# EAGLE schematic MainBoard_V1 (EAGLE 9.6.2)
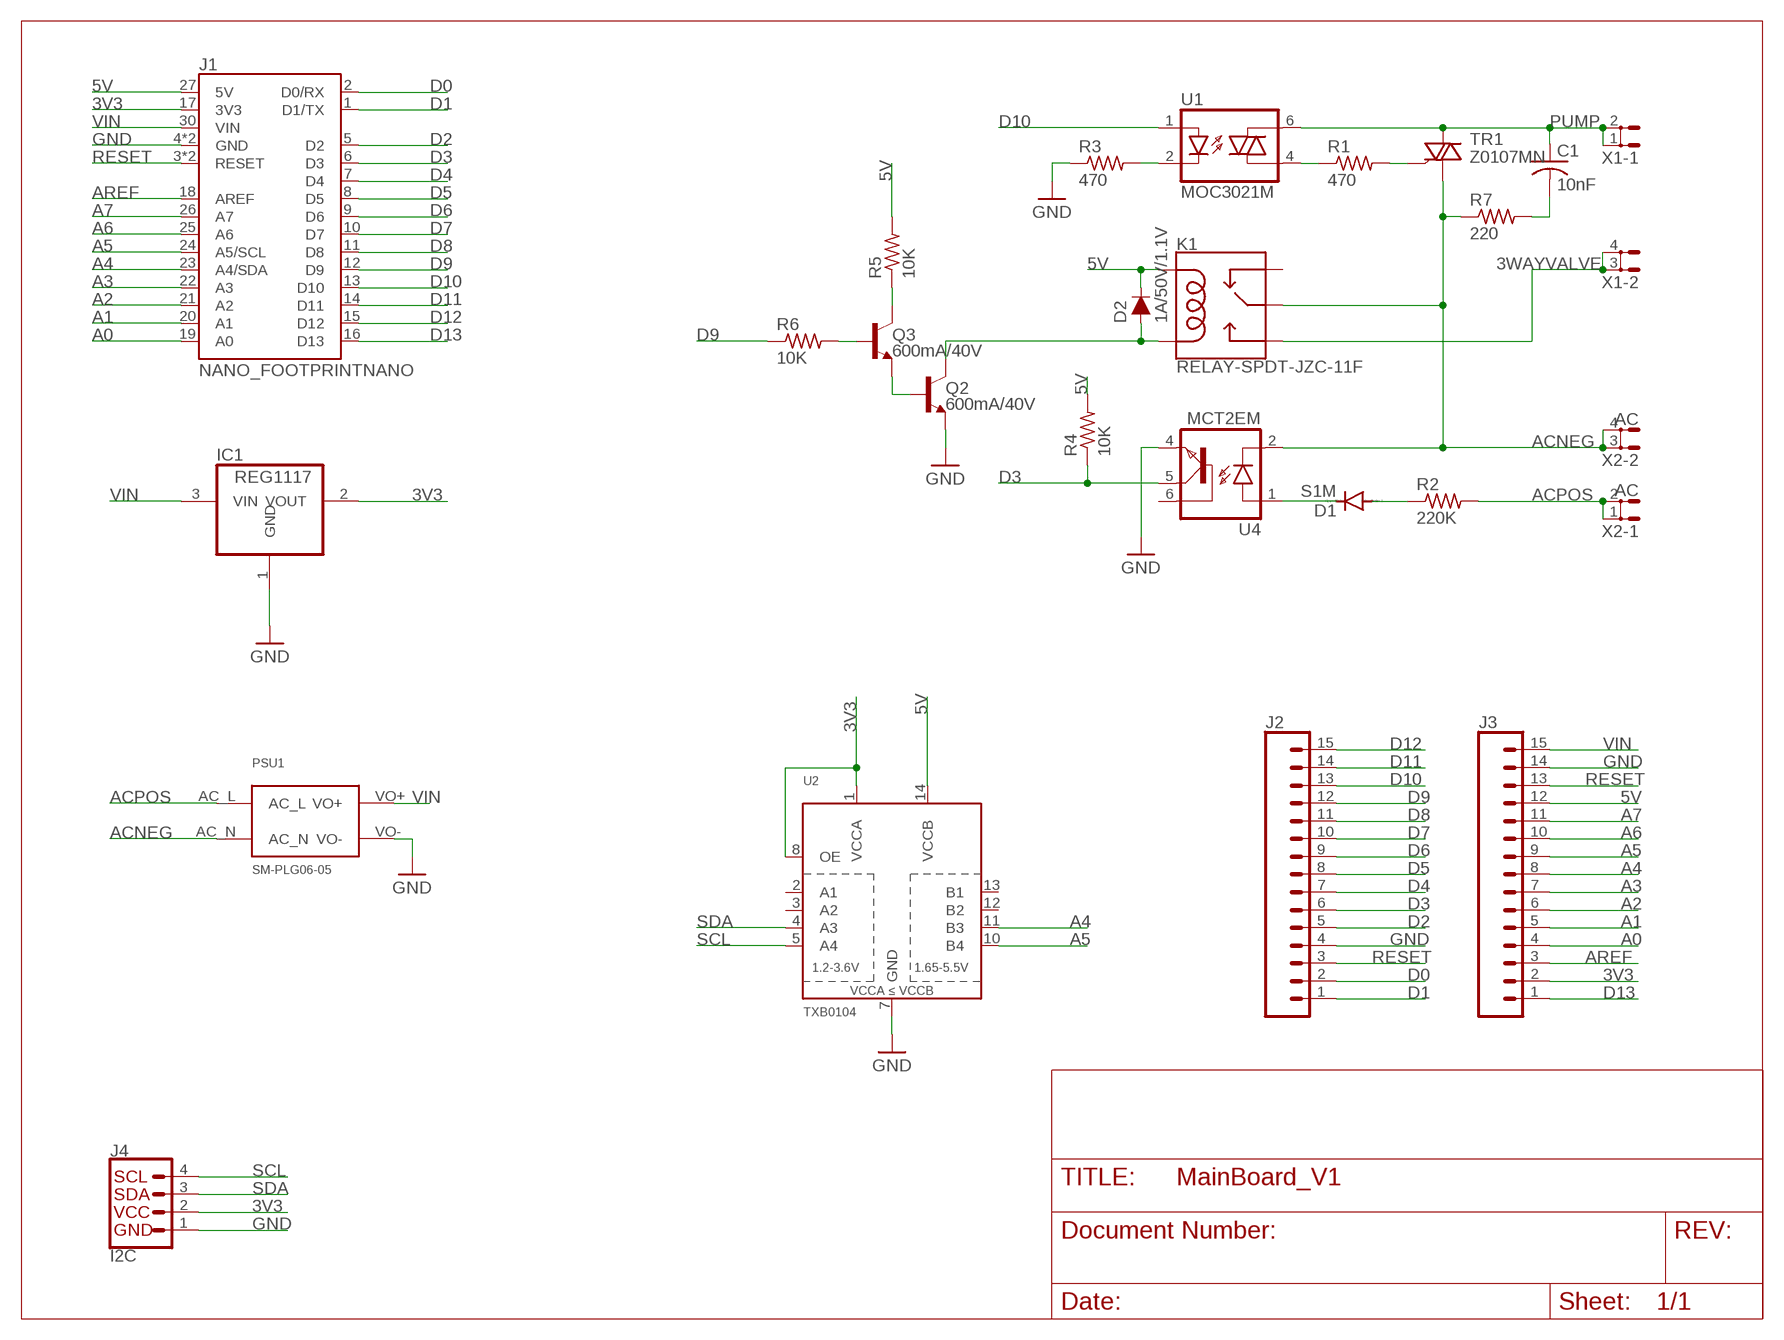
[diagram p0: schematic, sheet 1]

## Parts
C1  10nF  C-US075-032X103  [C075-032X103]
D1  S1M  [SMA]
D2  1A/50V/1.1V  DIODE-PTH  [DIODE-1N4001]
IC1  REG1117  [SOT223]
J1  NANO_FOOTPRINTNANO  [NANO]
J2  CONN_15  [1X15]
J3  CONN_15  [1X15]
J4  I2C  QWIIC_CONNECTOR  [JST04_1MM_VERT]
K1  RELAY-SPDT-JZC-11F  [RELAY-JZC]
PSU1  SM-PLG06-05  [SM-PLG06]
Q2  600mA/40V  TRANS_NPN-MMBT2222AL  [SOT23-3]
Q3  600mA/40V  TRANS_NPN-MMBT2222AL  [SOT23-3]
R1  470  R-US_R0402  [R0402]
R2  220K  R-US_R0603  [R0603]
R3  470  R-US_R0402  [R0402]
R4  10K  R-US_R0402  [R0402]
R5  10K  R-US_R0402  [R0402]
R6  10K  R-US_R0402  [R0402]
R7  220  R-US_R2512  [R2512]
TR1  Z0107MN  Z0107MNSOT-223  [SOT223]
U1  MOC3021M  [DIL06]
U2  TXB0104  TXB0104PWRSOIC14  [SO14]
U4  MCT2EM  [PDIP6_8P89X6P60_ONS]
X1  SH5-2  [SH5-2]
X2  AC  SH5-2  [SH5-2]

## Nets
3V3: IC1.2(VOUT) J1.17(3V3) J3.2 J4.2 U2.1(VCCA) U2.8(OE)
3WAYVALVE: K1.3(NO) X1.3 X1.4
5V: D2.C J1.27(5V) J3.12 K1.5(COIL1) R4.2 R5.2 U2.14(VCCB)
A0: J1.19(A0) J3.4
A1: J1.20(A1) J3.5
A2: J1.21(A2) J3.6
A3: J1.22(A3) J3.7
A4: J1.23(A4/SDA) J3.8 U2.11(B3)
A5: J1.24(A5/SCL) J3.9 U2.10(B4)
A6: J1.25(A6) J3.10
A7: J1.26(A7) J3.11
ACNEG: K1.4(MAIN) PSU1.AC_N R7.1 TR1.1(A1) U4.2(C) X2.3 X2.4
ACPOS: PSU1.AC_L R2.2 X2.1 X2.2
AREF: J1.18(AREF) J3.3
D0: J1.2(D0/RX) J2.2
D1: J1.1(D1/TX) J2.1
D2: J1.5(D2) J2.5
D3: J1.6(D3) J2.6 R4.1 U4.5(COL)
D4: J1.7(D4) J2.7
D5: J1.8(D5) J2.8
D6: J1.9(D6) J2.9
D7: J1.10(D7) J2.10
D8: J1.11(D8) J2.11
D9: J1.12(D9) J2.12 R6.1
D10: J1.13(D10) J2.13 U1.1(A)
D11: J1.14(D11) J2.14
D12: J1.15(D12) J2.15
D13: J1.16(D13) J3.1
GND: IC1.1(GND) J1.4(GND) J1.29(GND) J2.4 J3.14 J4.1 PSU1.VO- Q2.2(E) R3.1 U2.7(GND) U4.4(EMI)
N$1: R1.1 U1.4(A1)
N$2: R1.2 TR1.3(G)
N$3: R3.2 U1.2(C)
N$4: C1.2 R7.2
N$5: D1.A R2.1
N$6: D1.C U4.1(A)
N$8: Q2.1(B) Q3.2(E)
N$9: D2.A K1.1(COIL2) Q2.3(C)
N$10: Q3.3(C) R5.1
N$11: Q3.1(B) R6.2
PUMP: C1.1 TR1.2(A2) TR1.4(A2) U1.6(A2) X1.1 X1.2
RESET: J1.3(RESET) J1.28(RESET) J2.3 J3.13
SCL: J4.4 U2.5(A4)
SDA: J4.3 U2.4(A3)
VIN: IC1.3(VIN) J1.30(VIN) J3.15 PSU1.VO+
Unconnected: K1.2(NC) U2.2(A1) U2.3(A2) U2.12(B2) U2.13(B1) U4.6(BAS)

## Library data of the parts
C1 = rcl:C-US: CAPACITOR, American symbol; SPICEPREFIX: C
D1 = diode:S1M
D2 = SparkFun-DiscreteSemi:DIODE: Diode These are standard reverse protection diodes and small signal diodes. SparkFun Products: SparkFun SparkPunk Sound Kit <https://www.sparkfun.com/products/11177> SparkFun ESP8266 Thing <https://www.sparkfun.com/products/13231>; PROD_ID: DIO-09176
IC1 = burr-brown:REG1117: 800mA and 1A Low Dropout (LDO) Positive Regulator 1.8V, 2.5V, 2.85V, 3.3V, 5V, and Adj; MPN: REG1117; OC_FARNELL: 1097566; OC_NEWARK: 14P6981
J1 = SparkFun-Boards:NANO_FOOTPRINT: Generic Nano Footprint
J2 J3 = SparkFun-Connectors:CONN_15: Multi connection point. Often used as Generic Header-pin footprint for 0.1 inch spaced/style header connections On any of the 0.1 inch spaced packages, you can populate with these: Break Away Headers - Straight <https://www.sparkfun.com/products/116> (PRT-00116) Break Away Male Headers - Right Angle <https://www.sparkfun.com/products/553> (PRT-00553) Female Headers <https://www.sparkfun.com/products/115> (PRT-00115) Break Away Headers - Machine Pin <https://www.sparkfun.com/products/117> (PRT-00117) Break Away Female Headers - Swiss Machine Pin <https://www.sparkfun.com/products/743> (PRT-00743) For SCREWTERMINALS and SPRING TERMINALS visit here: Screw Terimnals on SparkFun.com <https://www.sparkfun.com/search/results?term=Screw+Terminals> (5mm/3.5mm/2.54mm spacing) This device is also useful as a general connection point to wire up your design to another part of your project. Our various solder wires solder well into these plated through hole pads. Hook-Up Wire - Assortment (Stranded, 22 AWG) <https://www.sparkfun.com/products/11375> (PRT-11375) Hook-Up Wire - Assortment (Solid Core, 22 AWG) <https://www.sparkfun.com/products/11367> (PRT-11367) View the entire wire category on our website here <https://www.sparkfun.com/categories/141> Special notes: Molex polarized connector foot print use with SKU : PRT-08231 with associated crimp pins and housings. 1MM SMD Version SKU: PRT-10208 NOTES ON THE VARIANTS LOCK and LOCK_LONGPADS... This footprint was designed to help hold the alignment of a through-hole component (i.e. 6-pin header) while soldering it into place. You may notice that each hole has been shifted either up or down by 0.005 of an inch from it's more standard position (which is a perfectly straight line). This slight alteration caused the pins (the squares in the middle) to touch the edges of the holes. Because they are alternating, it causes a "brace" to hold the component in place. 0.005 has proven to be the perfect amount of "off-center" position when using our standard breakaway headers. Although looks a little odd when you look at the bare footprint, once you have a header in there, the alteration is very hard to notice. Also,if you push a header all the way into place, it is covered up entirely on the bottom side.
J4 = SparkFun-Connectors:QWIIC_CONNECTOR: SparkFun I2C Standard Qwiic Connector An SMD 1mm pitch JST connector makes it easy and quick (get it? Qwiic?) to connect I2C devices to each other. The Qwiic system <http://www.sparkfun.com/qwiic> enables fast and solderless connection between popular platforms and various sensors and actuators. We carry 200mm <https://www.sparkfun.com/products/14204>, 100mm <https://www.sparkfun.com/products/14205>, 50mm <https://www.sparkfun.com/products/14206>, and breadboard friendly <https://www.sparkfun.com/products/14207> Qwiic cables. We also offer 10 pcs strips <https://www.sparkfun.com/products/14323> the SMD connectors.; PROD_ID: CONN-14483; VALUE: Vertical Qwiic Connector
K1 = SparkFun-Electromechanical:RELAY-SPDT: SPDT Electromechanical Relay Single-pole, double-throw sealed relays. When current is applied to the coil, it throws a simple changeover switch, terminating the connection from the NC contact to ground and closing the NO contact. Use them to switch high voltage/high current devices. SparkFun Products JQX-15F: Relay SPDT Sealed - 20A <https://www.sparkfun.com/products/10924> (COM-10924) JZC-11F: Relay SPDT Sealed <https://www.sparkfun.com/products/100> (COM-00100); PROD_ID: COMP-09533; SF_SKU: COM-00100
PSU1 = discrete:SM-PLG06-05: AC-DC 5V Isolated Switching Power Supply Module
Q2 Q3 = SparkFun-DiscreteSemi:TRANS_NPN: NPN transistor Current controlled devices typically used to amplify current or used as a switch. BC547 - COM-08928 <http://www.sparkfun.com/products/8928> (TO-92 45V 100mA) (1.Collector 2.Base 3.Emitter) 2N3904 - COM-00521 <http://www.sparkfun.com/products/521> (TO-92 40V 200mA) (1.Emitter 2.Base 3.Collector) P2N2222A - COM-12852 <http://www.sparkfun.com/products/12852> (TO-92 40V 600mA) (1.Collector 2.Base 3.Emitter); PROD_ID: TRANS-08049
R1-R7 = rcl:R-US_: RESISTOR, American symbol; SPICEPREFIX: R
TR1 = discrete:Z0107MN: Triacs 1.0 Amp 600 Volt
U1 = discrete:MOC3021M: RANDOM-PHASE OPTOISOLATORS TRIAC DRIVER OUTPUT
U2 = SparkFun-IC-Comms:TXB0104PWR: 4-Bit Bi-Directional Level Shifter 1.2V-3.6V (VCCA) to 1.65V-5.5V (VCCB) bi-directional level shifter with auto direction sensing. Max data rate - VCCA 1.8V: 20Mbps (50ns), VCCA 3.3V: 100Mbps (10ns) Digikey: 296-21929-1-ND (TSSOP) Datasheet <http://cdn.sparkfun.com/datasheets/BreakoutBoards/txb0104.pdf> SparkFun Products SparkFun Cellular Shield - MG2639 <https://www.sparkfun.com/products/13120> (CEL-13120) SparkFun Level Shifting microSD Breakout <https://www.sparkfun.com/products/13743> (DEV-13743) SparkFun Voltage-Level Translator Breakout - TXB0104 <https://www.sparkfun.com/products/11771> (BOB-11771) SparkFun Block for Intel® Edison - UART <https://www.sparkfun.com/products/13040> (DEV-13040) SparkFun Block for Intel® Edison - Arduino <https://www.sparkfun.com/products/13036> (DEV-13036); PROD_ID: IC-11329
U4 = MCT2EM_Sym:MCT2EM; COPYRIGHT: Copyright (C) 2021 Ultra Librarian. All rights reserved.; MANUFACTURER_PART_NUMBER: MCT2EM; MFR_NAME: ON Semiconductor
X1 X2 = con-rib:SH5-2: RIBBON CABLE CONNECTOR Flachstecker / Faston; OC_FARNELL: unknown; OC_NEWARK: unknown